# Altium project Project_Jack_DC_V2.00.PrjPcb
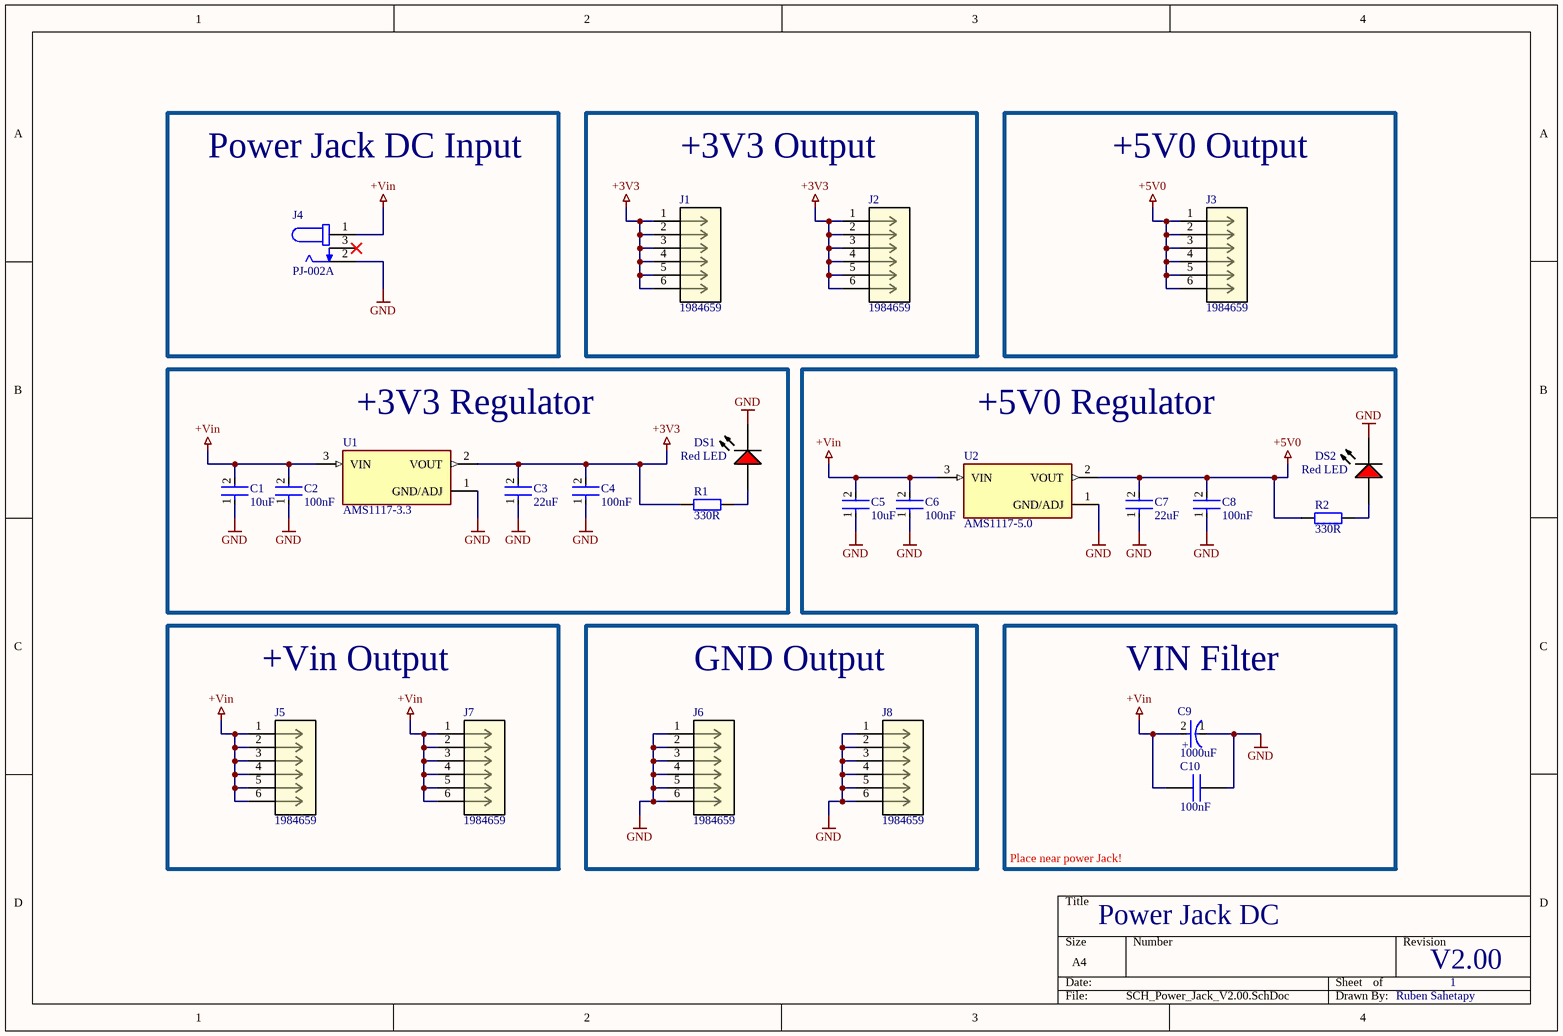
[diagram p0: SCH_Power_Jack_V2.00.SchDoc]
1 sheet, 24 parts. Net scope: global (net labels, ports and power ports of the same name join across sheets).
Board file: PCB_Power_Jack_V2.00.PcbDoc

## Sheet SCH_Power_Jack_V2.00.SchDoc
size A4; SheetNumber: 1; SheetTotal: 1

### Parts
C1  10uF  [FP-C0805C-DG-MFG]
C2  100nF  [FP-C0805C-DG-MFG]
C3  22uF  [FP-C0805C-DG-MFG]
C4  100nF  [FP-C0805C-DG-MFG]
C5  10uF  [FP-C0805C-DG-MFG]
C6  100nF  [FP-C0805C-DG-MFG]
C7  22uF  [FP-C0805C-DG-MFG]
C8  100nF  [FP-C0805C-DG-MFG]
C9  1000uF  [FP-OS-CON-SMT-F10-MFG]
C10  100nF  [CAP0805]
DS1  Red LED  [LUMX-SML-LX1206IC_V]
DS2  Red LED  [LUMX-SML-LX1206IC_V]
J1  1984659  [CONN_1984659_PXC]
J2  1984659  [CONN_1984659_PXC]
J3  1984659  [CONN_1984659_PXC]
J4  PJ-002A  [CUI_PJ-002A]
J5  1984659  [CONN_1984659_PXC]
J6  1984659  [CONN_1984659_PXC]
J7  1984659  [CONN_1984659_PXC]
J8  1984659  [CONN_1984659_PXC]
R1  330R  [RES1206]
R2  330R  [RES1206]
U1  AMS1117-3.3  [SOT229P700X180-4N]
U2  AMS1117-5.0  [SOT229P700X180-4N]

### Blocks framed on the sheet
Power Jack DC Input: J4
+3V3 Output: J1 J2
+5V0 Output: J3
+3V3 Regulator: C1-C4 DS1 R1 U1
+5V0 Regulator: C5-C8 DS2 R2 U2
+Vin Output: J5 J7
GND Output: J6 J8
VIN Filter: C9 C10

### Nets
+3V3: C3.2 C4.2 J1.1 J1.2 J1.3 J1.4 J1.5 J1.6 J2.1 J2.2 J2.3 J2.4 J2.5 J2.6 R1.1 U1.2(VOUT)
+5V0: C7.2 C8.2 J3.1 J3.2 J3.3 J3.4 J3.5 J3.6 R2.1 U2.2(VOUT)
+Vin: C1.2 C2.2 C5.2 C6.2 C9.2(A) C10.1 J4.1 J5.1 J5.2 J5.3 J5.4 J5.5 J5.6 J7.1 J7.2 J7.3 J7.4 J7.5 J7.6 U1.3(VIN) U2.3(VIN)
GND: C1.1 C2.1 C3.1 C4.1 C5.1 C6.1 C7.1 C8.1 C9.1(C) C10.2 DS1.2(K) DS2.2(K) J4.2 J6.1 J6.2 J6.3 J6.4 J6.5 J6.6 J8.1 J8.2 J8.3 J8.4 J8.5 J8.6 U1.1(GND/ADJ) U2.1(GND/ADJ)
NetDS1_1: DS1.1(A) R1.2
NetDS2_1: DS2.1(A) R2.2

Not connected (* = marked no-connect by the designer): J4 3*

### Notes on the sheet
- Place near power Jack!
- Power Jack DC
- V2.00
- 1
- Ruben Sahetapy
- (in symbol CMP-05428-000276-1) +

### Library data of the parts
C1-C8 = CMP-2007-03243-2: CAP CER 10UF 10V X5R 0805; Manufacturer Part Number: C0805C106K8PACTU; Manufacturer: Kemet; 3DS Part Number: 220-00001; Tolerance: 10%; Temperature Coefficient: 15%; Material: Ceramic; Device Class L2: Capacitors; Device Class L1: Passive Components; ComponentLink2URL: https://content.kemet.com/datasheets/KEM_C1006_X5R_SMD.pdf; Height: 1.4mm; Lead Free: Yes; Digikey Description: CAP CER 10UF 10V X5R 0805; Octopart: https://octopart.com/c0805c106k8pactu-kemet-98697; Capacitance: 10uF; Value: 10uF; Temperature Range Low: -55°C; Temperature: -55°C to +85°C; Automotive: No; Mouser Description: CAP CER 10UF 10V X5R 0805; Ipc Land Pattern Name: CAPC200125X125; Temperature Range High: +85°C; Voltage: 10V; RoHS: TRUE; Device Class L3: Ceramic Capacitors; ComponentLink2Description: Datasheet; Voltage Rating: 10V; Package: C0805C-DG; Temperature Characteristic: X5R; Category: Cap
C9 = CMP-05428-000276-1: CAP ALUM POLY 1000UF 20% 16V SMD; RoHS Compliant: Yes
C10 = Capacitor 0805: Value: 805; MF: Yageo; MP: CC0805KRX7R9BB104; SnapEDA_Link: https://www.snapeda.com/parts/CC0805KRX7R9BB104/Yageo/view-part/?ref=snap; Package: 0805 Yageo; Check_prices: https://www.snapeda.com/parts/CC0805KRX7R9BB104/Yageo/view-part/?ref=eda; Part Number: Capacitor 0805; PartID: Capacitor 0805; TempMin: -55; TempMax: 125; Link: -
DS1 DS2 = CMP-2000-07123-1: LED Red, 65 mW, -40 to 85 degC, 2-Pin SMD, RoHS, Tape and Reel; Manufacturer: Lumex; Part No: SML-LX1206IC-TR; LED Material: GaAsP; Peak Wavelength: 635nm; Number of LEDs: 1; Viewing Angle: 160; Reverse Voltage: 5(Min)V; Lens Appearance: ColorlessNonDiffused; Intensity: 6mcd; Type: Uni-Color; Pin_Count: 2; Lens Dimensions: 2x1.6x0.5mm; Mounting: SurfaceMount; ECCN: EAR99; RoHS: Unknown; Package Description: 2-Pin Surface Mount Device, Body 3.2 x 1.5 mm; Mounting Technology: SurfaceMount; Dominant Wavelength: N/A; Supplier_Package: SMD; Supplier Standard Pack: 3,000; Color: Red; Dimension: 3.2x1.6x1.1mm; HTS: 8541402000; Family: SML-LX1206IC; Supplier: Lumex; Datasheet URL: http://www.lumex.com/content/files/ProductAttachment/SML-LX1206IC-TR.pdf; Package Reference: SML-LX1206IC; Manufacturer URL: http://www.lumexinstruments.com/; Operating Temperature: -25to85C; Packaging: TapeandReel; Datasheet Version: Rev. J, 08/2012
J1-J3 J5-J8 = 1984659: 6 Position Wire to Board Terminal Block Horizontal with Board 0.138" (3.50mm) Through Hole; Manufacturer_Name: Phoenix Contact; Value: 6 Pos 3.5mm; Copyright: Copyright (C) 2025 Ultra Librarian. All rights reserved.; Manufacturer_Part_Number: 1984659; RefDes: RefDes; Type: Type; Part Number: 1984659; PartID: 1984659; TempMin: -40; TempMax: 125; Link: https://www.digikey.de/en/products/detail/phoenix-contact/1984659/950852
J4 = PJ-002A: DC Power Connectors Power Jacks 2x5.5mm; Value: 2.5A @ 24 VDC; MF: Same Sky; SnapEDA_Link: https://www.snapeda.com/parts/PJ-002A/Same+Sky/view-part/?ref=snap; Package: None; MP: PJ-002A; Check_prices: https://www.snapeda.com/parts/PJ-002A/Same+Sky/view-part/?ref=eda; Part Number: PJ-002A; PartID: PJ-002A; TempMin: -25; TempMax: 85; Link: https://www.sameskydevices.com/product/resource/pj-002a.pdf
R1 R2 = Resistor 1206: Value: 1206; Part Number: Resistor 1206; PartID: Resistor 1206; TempMin: -55; TempMax: 125; Link: -
U1 U2 = AMS1117-3.3: Linearer Spannungsregler, 800 mA, 15 V; Value: 0.8A, 15V; MF: Advanced Monolithic Systems; SnapEDA_Link: https://www.snapeda.com/parts/AMS1117-3.3/Advanced+Monolithic+Systems/view-part/?ref=snap; Package: SOT-223 Seeed Technology; MP: AMS1117-3.3; Check_prices: https://www.snapeda.com/parts/AMS1117-3.3/Advanced+Monolithic+Systems/view-part/?ref=eda; Part Number: AMS1117-3.3; PartID: AMS1117-3.3; TempMin: -40; TempMax: 125; Link: https://www.snapeda.com/parts/AMS1117-3.3/Advanced%20Monolithic%20Systems/datasheet/